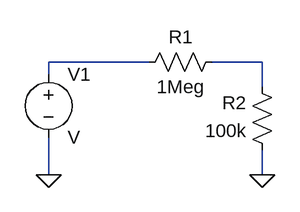
[diagram p0: schematic DigitalInput.asc]
DigitalInput.asc, the LTspice schematic file:
Version 4
SHEET 1 880 680
WIRE 80 128 -48 128
WIRE 224 128 160 128
WIRE -48 144 -48 128
WIRE 224 160 224 128
WIRE -48 272 -48 224
WIRE 224 272 224 240
FLAG -48 272 0
FLAG 224 272 0
SYMBOL res 176 112 R90
WINDOW 0 0 56 VBottom 2
WINDOW 3 32 56 VTop 2
SYMATTR InstName R1
SYMATTR Value 1Meg
SYMBOL res 240 256 R180
WINDOW 0 36 76 Left 2
WINDOW 3 36 40 Left 2
SYMATTR InstName R2
SYMATTR Value 100k
SYMBOL voltage -48 128 R0
SYMATTR InstName V1

The netlist it stands for:
* DigitalInput.asc
R1 N002 N001 1Meg
R2 0 N002 100k
V1 N001 0 V
.backanno
.end